# EAGLE design Tail_Power_PCB (EAGLE 9.6.2)
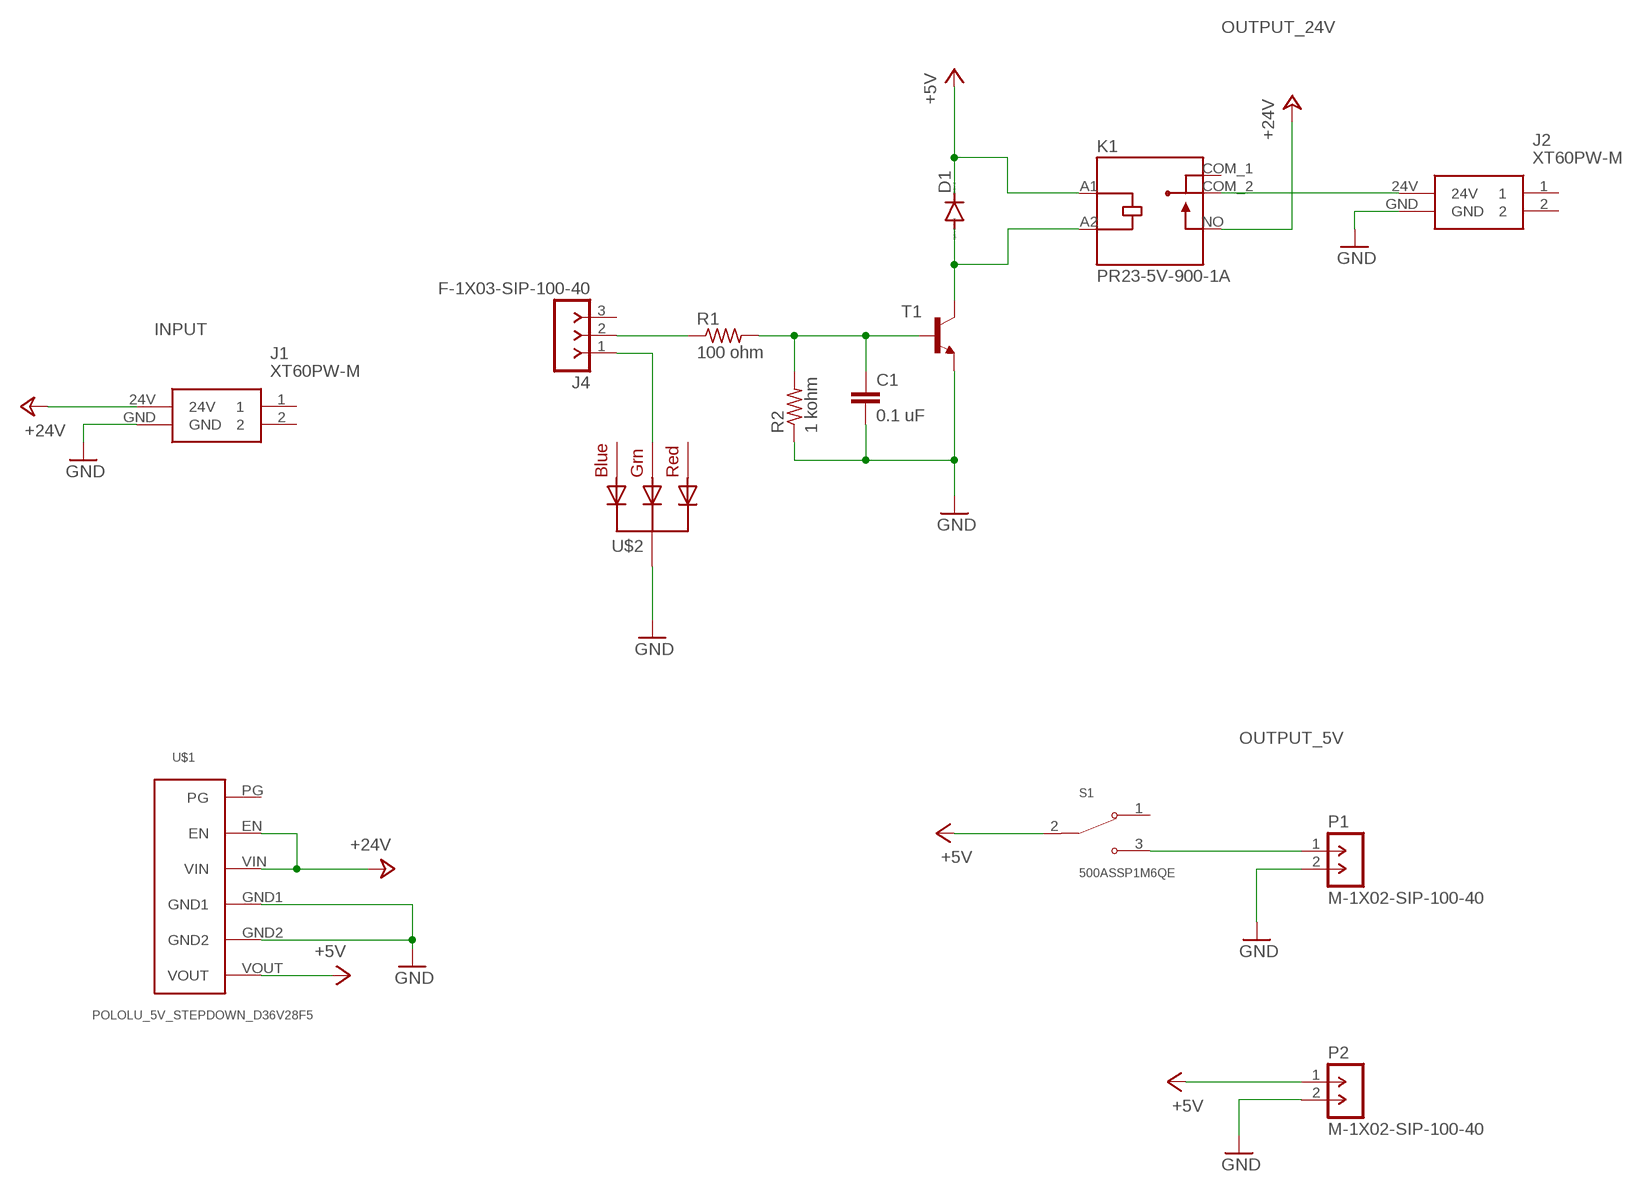
[diagram p0: schematic, sheet 1]

## Parts
C1  0.1 uF  C10/4  [C10B4]
D1  DIODE-DO41-7.6  [DO41-7.6]
J1  XT60PW-M  [XT60PWM]
J2  XT60PW-M  [XT60PWM]
J4  F-1X03-SIP-100-40  [SIP-100-03-40]
K1  PR23-5V-900-1A  [RELAY_PR23-5V-900-1A]
P1  M-1X02-SIP-100-40  [SIP-100-02-40]
P2  M-1X02-SIP-100-40  [SIP-100-02-40]
R1  100 ohm  R-US_0204/7  [0204/7]
R2  1 kohm  R-US_0204/7  [0204/7]
S1  500ASSP1M6QE  [SW_500ASSP1M6QE]
T1  -NPN-TO92  [TO92]
U$1  POLOLU_5V_STEPDOWN_D36V28F5  [MODULE_POLOLU_3782]
U$2  KINGBRIGHT_LED  [LEDWP154A4SUREQBFZGW]

## Nets
+5V: D1.C K1.A1(COIL1) P2.1 S1.2(COM) U$1.VOUT
+24V: J1.24V K1.NO U$1.EN U$1.VIN
GND: C1.2 J1.GND J2.GND P1.2 P2.2 R2.1 T1.1(E) U$1.GND1 U$1.GND2 U$2.GND
N$1: P1.1 S1.3(NO)
N$2: J2.24V K1.COM_2(COM2)
N$3: C1.1 R1.2 R2.2 T1.2(B)
N$4: J4.2 R1.1
N$5: J4.1 U$2.GRN(GREEN)
N$7: D1.A K1.A2(COIL2) T1.3(C)
Unconnected: J1.1 J1.2 J2.1 J2.2 J4.3 K1.COM_1(COM1) S1.1(NC) U$1.PG U$2.BLU(BLUE) U$2.RED

## Notes on the sheet
- OUTPUT_24V
- INPUT
- OUTPUT_5V

## Library data of the parts
C1 = capacitor-wima:C: CAPACITOR naming: grid - package width
D1 = diode:DIODE-: DIODE
J1 J2 = Prune_Bot_V1:XT60PW-M: Socket; DC supply; XT60; male; PIN: 2; on PCBs; THT; Colour: yellow Source: Datasheet <https://www.tme.eu/Document/9b8d0c5eb7094295f3d3112c214d3ade/XT60PW SPEC.pdf>; DESCRIPTION: Socket; DC supply; XT60; male; PIN: 2; on PCBs; THT; Colour: yellow; HEIGHT: 8.4mm; MANUFACTURER_NAME: Changzou Amass Elec; MANUFACTURER_PART_NUMBER: XT60PW-M
J4 = con-headers-jp:F-1X03-: FEMALE HEADER
K1 = Prune_Bot_V1:PR23-5V-900-1A; MANUFACTURER: CUI Devices; MAXIMUM_PACKAGE_HEIGHT: 20.3mm; PARTREV: 1.0; STANDARD: Manufacturer Recommendations
P1 P2 = con-headers-jp:M-1X02-: MALE HEADER
R1 R2 = adafruit:R-US_: RESISTOR, American symbol
S1 = Prune_Bot_V1:500ASSP1M6QE; MANUFACTURER: E-Switch; MAXIMUM_PACKAGE_HEIGHT: 5.59 mm; PARTREV: C; SNAPEDA_PN: 500ASSP1M6QE; STANDARD: Manufacturer Recommendations
T1 = transistor:*-NPN-: NPN Transistror BF959 corrected 2008.03.06
U$1 = Prune_Bot_V1:POLOLU_5V_STEPDOWN_D36V28F5
U$2 = Prune_Bot_V1:KINGBRIGHT_LED

## Board
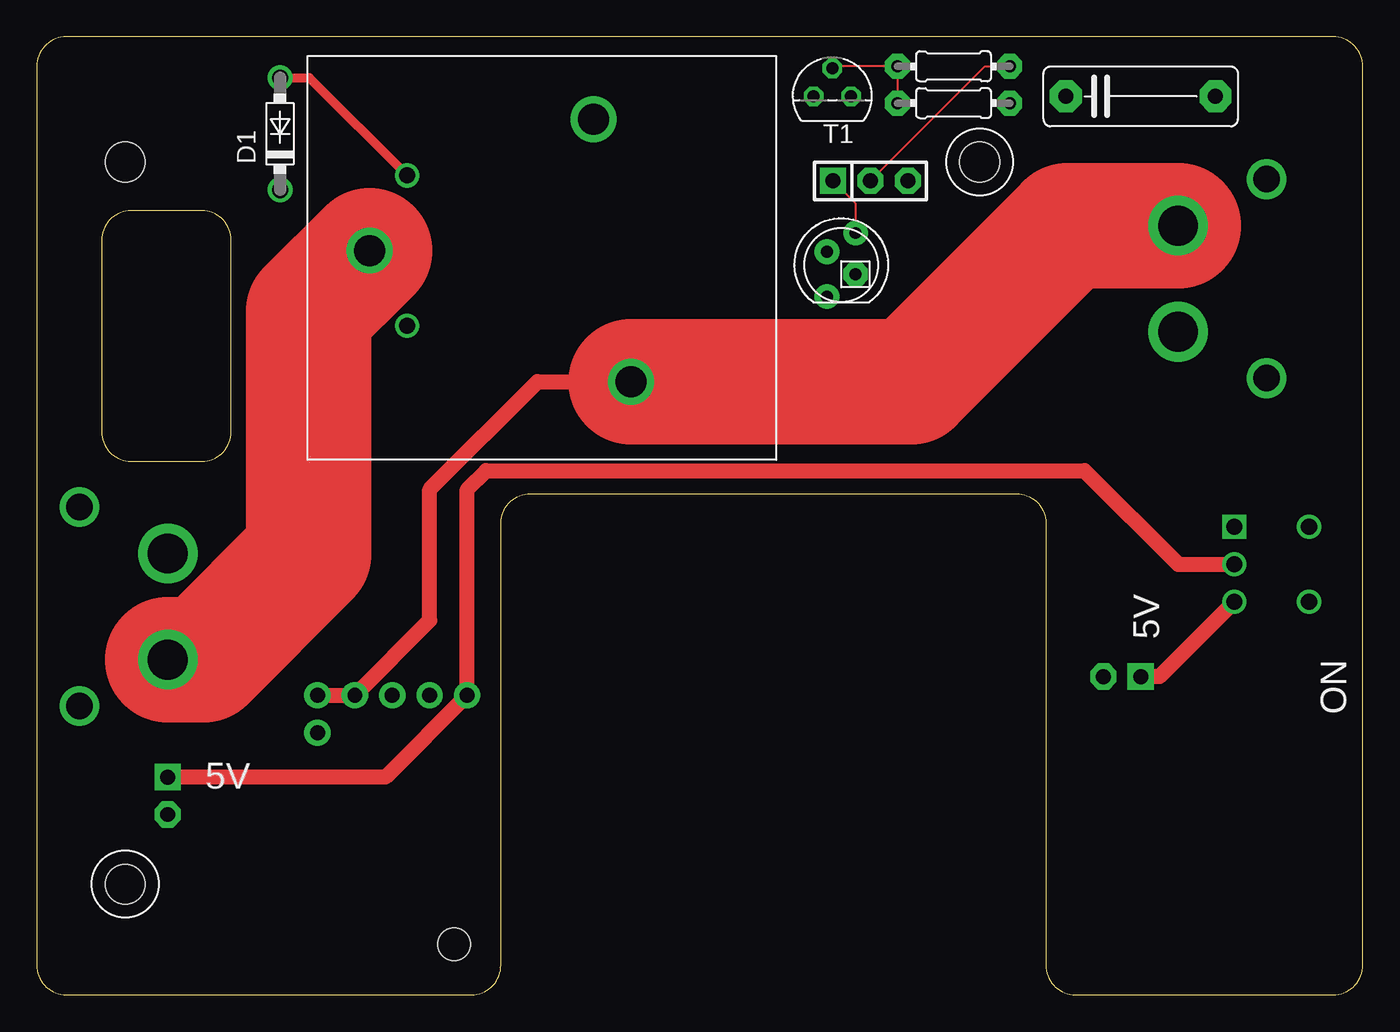
[diagram p1: board, top side]
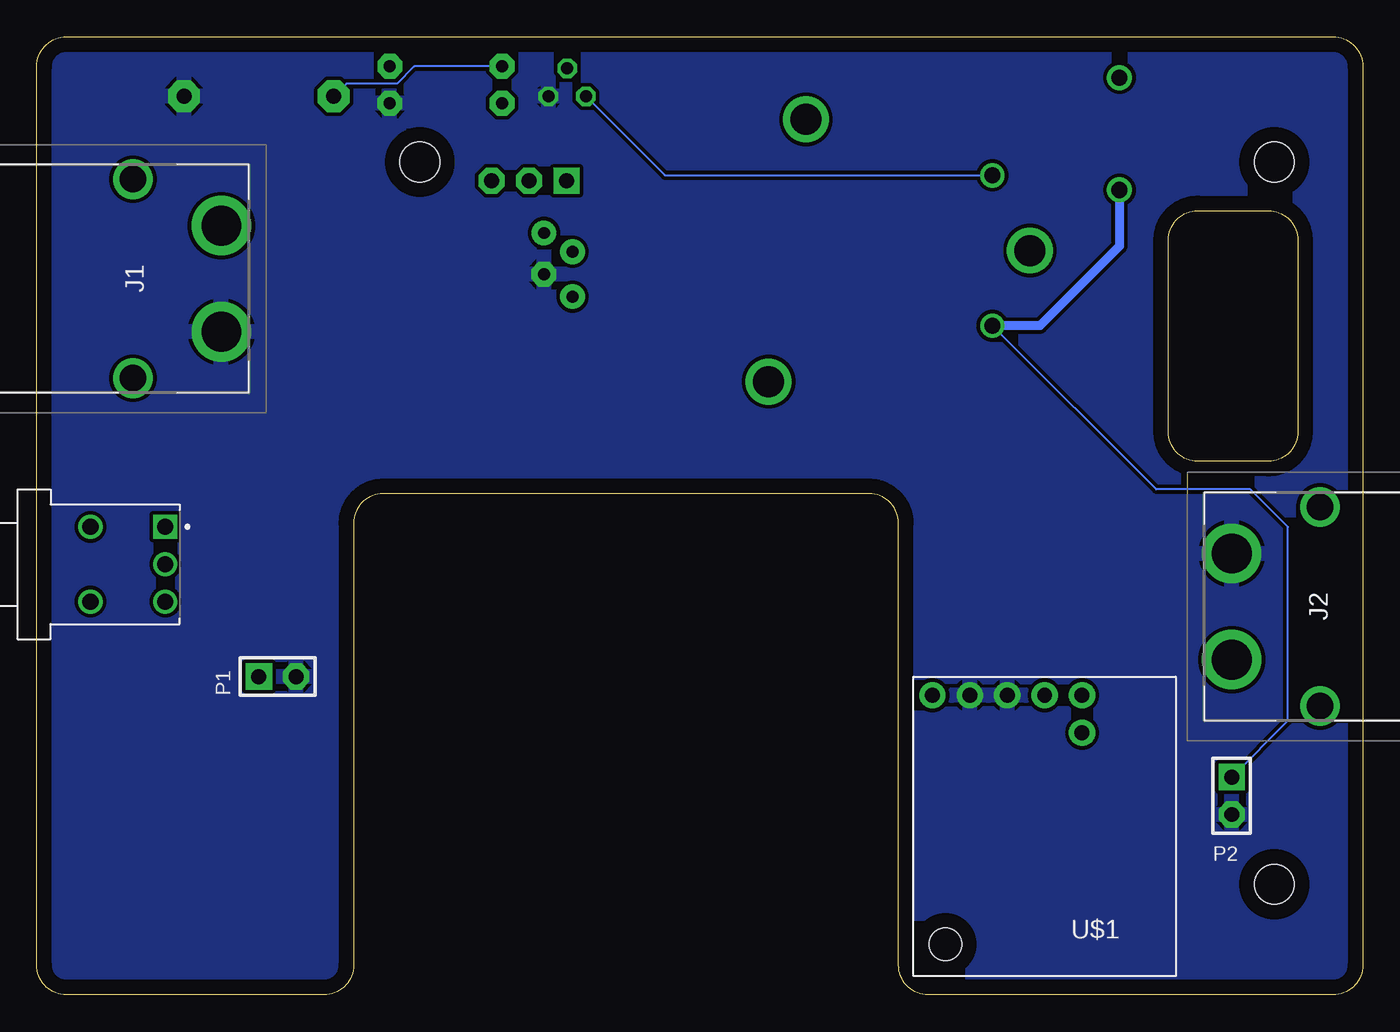
[diagram p2: board, bottom side, seen from below]

Size 90 x 65 mm. Coordinates in mm from the lower left corner, seen from the top.
Outline: 70.5,0 88,0 arc90 90,2 90,63 arc90 88,65 2,65 arc90 0,63 0,2 arc90 2,0 29.5,0 arc90 31.5,2 31.5,32 arc-90 33.5,34 66.5,34 arc-90 68.5,32 68.5,2 arc90 70.5,0
Outline: 13.2,38.2 13.2,51.2 arc90 11.2,53.2 6.4,53.2 arc90 4.4,51.2 4.4,38.2 arc90 6.4,36.2 11.2,36.2 arc90 13.2,38.2
Copper layers (1*16): Top 0.035mm / dielectric 1.5mm / Bottom 0.035mm
Design rules "default *": minimum track width 6mil, minimum drill 0.35mm, track to track 10mil, track to pad 10mil, pad to pad 10mil, via to via 10mil, smd to smd 10mil, copper to edge 40mil, drill to drill 6mil, minimum pad ring 10mil, minimum via ring 8mil, stop-mask expansion 4mil, vias tented up to drill 0mil, thermal gap 10mil
Holes 2.7 mm at 6,7.5 6,56.5 64,56.5

### Footprints (pad centres in the part's own frame; a part is rotated, then mirrored left to right if it is on the bottom)
C10B4 = drill 1.016 pad 2.159 octagon: 1 -5.08,0; 2 5.08,0
DO41-7.6 = drill 1.1 pad 1.7: A 3.81,0; C -3.81,0
XT60PWM = drill 1.8 pad 2.7: 1 -6.75,6; 2 6.75,6 | drill 2.7 pad 4.05: 24V 3.6,0; GND -3.6,0
SIP-100-03-40 = drill 1.016 pad 1.778 square: 1 -2.54,0 | drill 1.016 pad 1.778 octagon: 2 0,0; 3 2.54,0
RELAY_PR23-5V-900-1A = drill 1.1: A1 4.6,-9.16; A2 -5.6,-9.16 | drill 2.1: COM_1 -9.4,3.5; COM_2 -0.5,-11.7; NO 8.4,6.04
SIP-100-02-40 = drill 1.016 pad 1.778 square: 1 -1.27,0 | drill 1.016 pad 1.778 octagon: 2 1.27,0
0204/7 = drill 0.813 pad 1.676 octagon: 1 -3.81,0; 2 3.81,0
SW_500ASSP1M6QE = drill 1.09 square: 1 -2.54,5.08 | drill 1.09: 2 0,5.08; 3 2.54,5.08; S1 -2.54,0; S2 2.54,0
TO92 = drill 0.813 octagon: 1 1.27,0; 2 0,1.905; 3 -1.27,0
MODULE_POLOLU_3782 = drill 1.016 pad 1.778: EN 6.35,1.27; GND1 11.43,1.27; GND2 13.97,1.27; PG 6.35,3.81; VIN 8.89,1.27; VOUT 16.51,1.27 | hole 2.184: 15.621,18.161
LEDWP154A4SUREQBFZGW = drill 0.8 pad 1.676: BLU 0.889,0.968; GRN 2.159,-0.968; RED -2.159,0.968 | drill 0.8 pad 1.676 octagon: GND -0.635,-0.968

### Placement (x,y rotation side)
C1  74.93,60.96 0 top
D1  16.51,58.42 90 top
J1  77.47,48.59 90 bottom
J2  8.89,26.34 270 bottom
J4  56.59,55.23 0 top
K1  34.29,50 270 top
P1  73.66,21.59 0 bottom
P2  8.89,13.5 270 bottom
R1  62.23,63 180 top
R2  62.23,60.5 180 top
S1  86.36,29.21 270 bottom
T1  54,60.96 0 top
U$1  12.7,21.59 180 bottom
U$2  54.61,49.53 90 top

### Tracks (layer width: path | path; a pad name or v marks a point on that pad's centre or on a via)
+5V
  Top 1.016: S1.2 77.47,29.21 71.12,35.56 30.48,35.56 29.21,34.29 U$1.VOUT 23.66,14.77 P2.1
  Bottom 0.152: P2.1 5.08,18.58 5.08,31.75 7.62,34.29 14.02,34.29 K1.A1
  Bottom 0.61: D1.C 16.51,50.8 21.91,45.4 K1.A1
+24V
  Top 1.016: U$1.EN U$1.VIN 26.67,25.4 26.67,34.29 33.98,41.6 K1.NO
  Top 8.5: J1.24V 69.97,52.19 59.38,41.6 K1.NO
GND
  pour Bottom: -1.27,67.31 -1.27,-2.54 92.71,-2.54 92.71,67.31
N$1
  Top 1.016: S1.3 76.2,21.59 P1.1
N$2
  Top 8.5: J2.24V 11.31,22.74 18.47,29.9 18.47,45.72 18.47,45.91 18.47,46.38 K1.COM_2
N$3
  Top 0.152: R2.2 R1.2 54.13,63 T1.2
  Bottom 0.152: R1.2 64.39,63 65.56,61.83 68.98,61.83 C1.1
N$4
  Top 0.152: J4.2 64.36,63 R1.1
N$5
  Top 0.152: J4.1 55.58,53.7 U$2.GRN
N$7
  Top 0.61: D1.A 18.5,62.23 K1.A2
  Bottom 0.152: T1.3 47.37,55.6 K1.A2

### Text on the board
tPlace: 5V | ON | 5V